# Altium schematic sheet 14-MT7688AN USB-PCIe.SchDoc
size A4
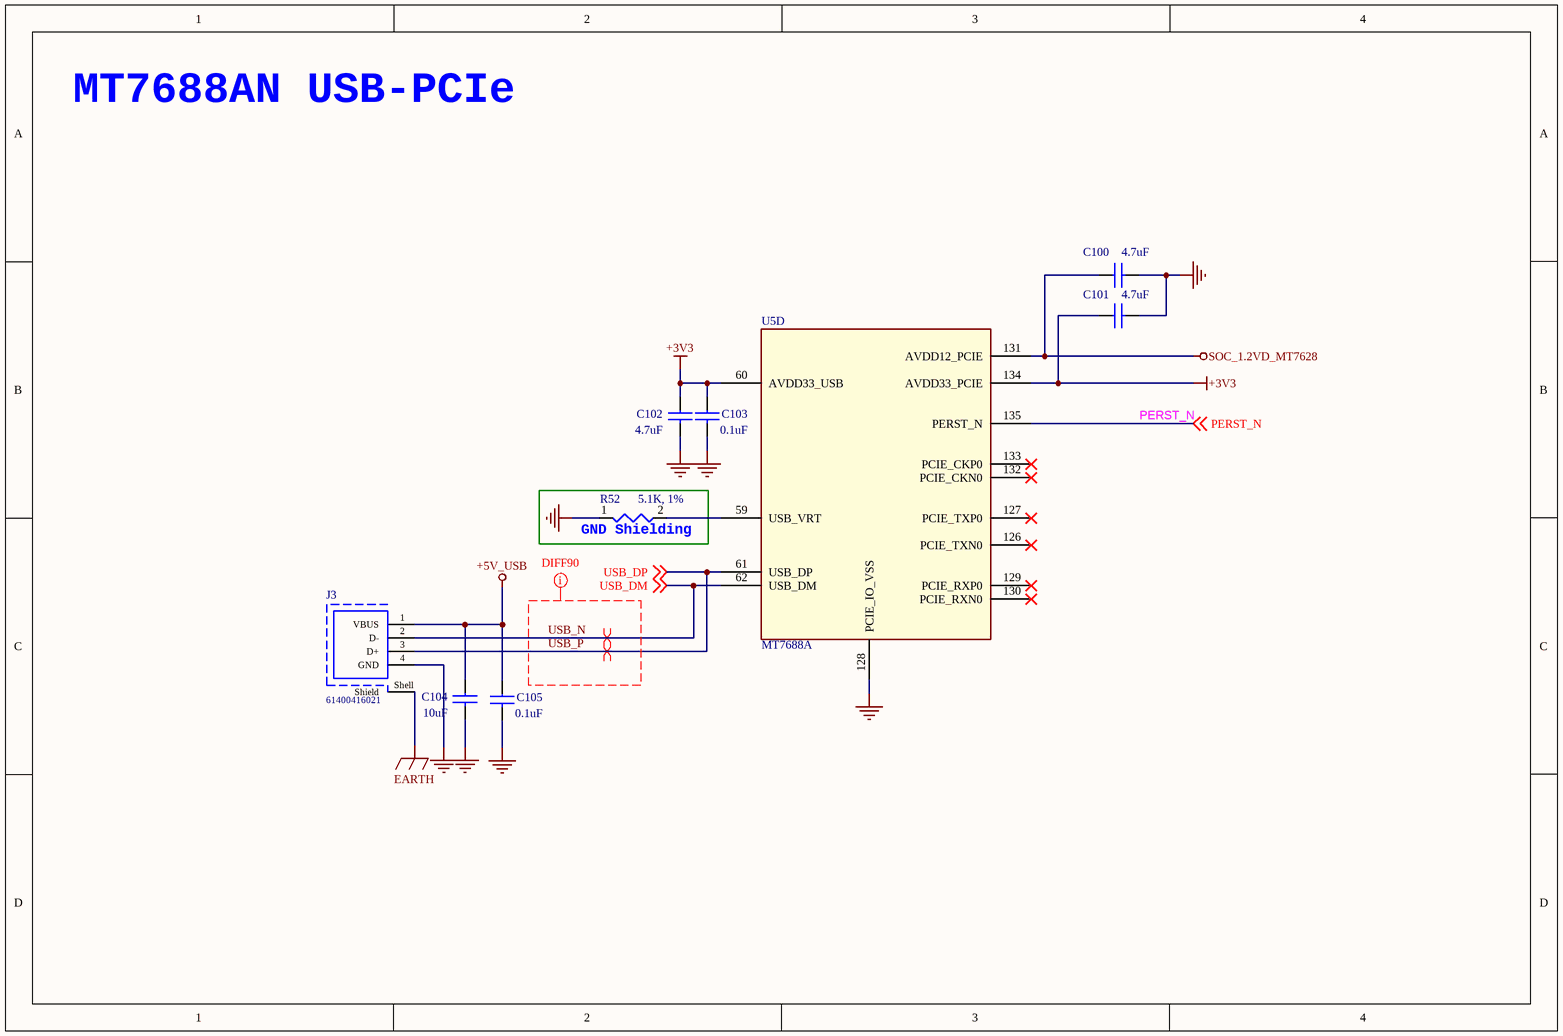
[diagram p0: 14-MT7688AN USB-PCIe.SchDoc]

## Parts
C100  4.7uF  [CAPC1005X60X30LL05T10 - duplicate]
C101  4.7uF  [CAPC1005X60X30LL05T10 - duplicate]
C102  4.7uF  [CAPC1005X60X30NL05T10]
C103  0.1uF  [CAPC1005X60X30NL05T10]
C104  10uF  [CAPC1608X90X35NL10T15]
C105  0.1uF  [CAPC1005X60X30LL05T10 - duplicate]
J3  61400416021  [61400416021]
R52  5.1K, 1%  [RESC1005X40X25NL05T10 - duplicate]
U5  MT7688A  [MT7628AN$2F$DRQFN156$2F$SMD$2F$P0.5$2F$12X12]  (part D of 6)

## Blocks framed on the sheet
GND Shielding: R52

## Nets
+3V3: C101.1 C102.1 C103.1 U5.60(AVDD33_USB) U5.134(AVDD33_PCIE)
+5V_USB: C104.1 C105.1 J3.1(VBUS)
EARTH: J3.Shell(Shield)
GND: C100.2 C101.2 C102.2 C103.2 C104.2 C105.2 J3.4(GND) R52.1 U5.128(PCIE_IO_VSS)
SOC_1.2VD_MT7628: C100.1 U5.131(AVDD12_PCIE)
PERST_N: U5.135(PERST_N) ; off-sheet PERST_N
USB_N: J3.2(D-) U5.62(USB_DM) ; off-sheet USB_DM  [also labelled USB_DM]
USB_P: J3.3(D+) U5.61(USB_DP) ; off-sheet USB_DP  [also labelled USB_DP]
NetR52_2: R52.2 U5.59(USB_VRT)

Not connected (* = marked no-connect by the designer): U5 126(PCIE_TXN0)* 127(PCIE_TXP0)* 129(PCIE_RXP0)* 130(PCIE_RXN0)* 132(PCIE_CKN0)* 133(PCIE_CKP0)*

## Layout directives
net class USB; rule Differential Pairs Routing [Pref Gap = 0.185mm    Min Gap  = 0.1mm    Max Gap  = 0.185mmPref Width = 0.1mm    Min Width  = 0.1mm    Max Width  = 0.1mm]; rule Matched Net Lengths [Tolerance = 20mil]: USB_N, USB_P
differential pair: USB_N, USB_P

## Notes on the sheet
- MT7688AN USB-PCIe

## Library data of the parts
C100-C105 = CAP NP
J3 = CMP-1502-03227-1: USB 2.0 Type A Receptacle WR-COM, Horizontal, THT; Manufacturer: Wurth Elektronik; Working Voltage: 30VAC; Rated Current: 1.5A; Contact Resistance: 20mOhm; Manufacturer URL: http://www.we-online.de; Publisher: WurthElektronik; Packaging: Tray; Operating Temperature: -40to105degC; Orientation: Horizontal; Mounting Technology: THT; Part Number: 61400416021; Gender: Receptacle; Package Reference: 61400416021; Connector Type: USB2.0TypeA; Datasheet URL: https://katalog.we-online.de/em/datasheet/61400416021.pdf
R52 = RES/0402_3
U5 = MT7620N-n_26